# EAGLE board misko_3_board (EAGLE 8.1.1)
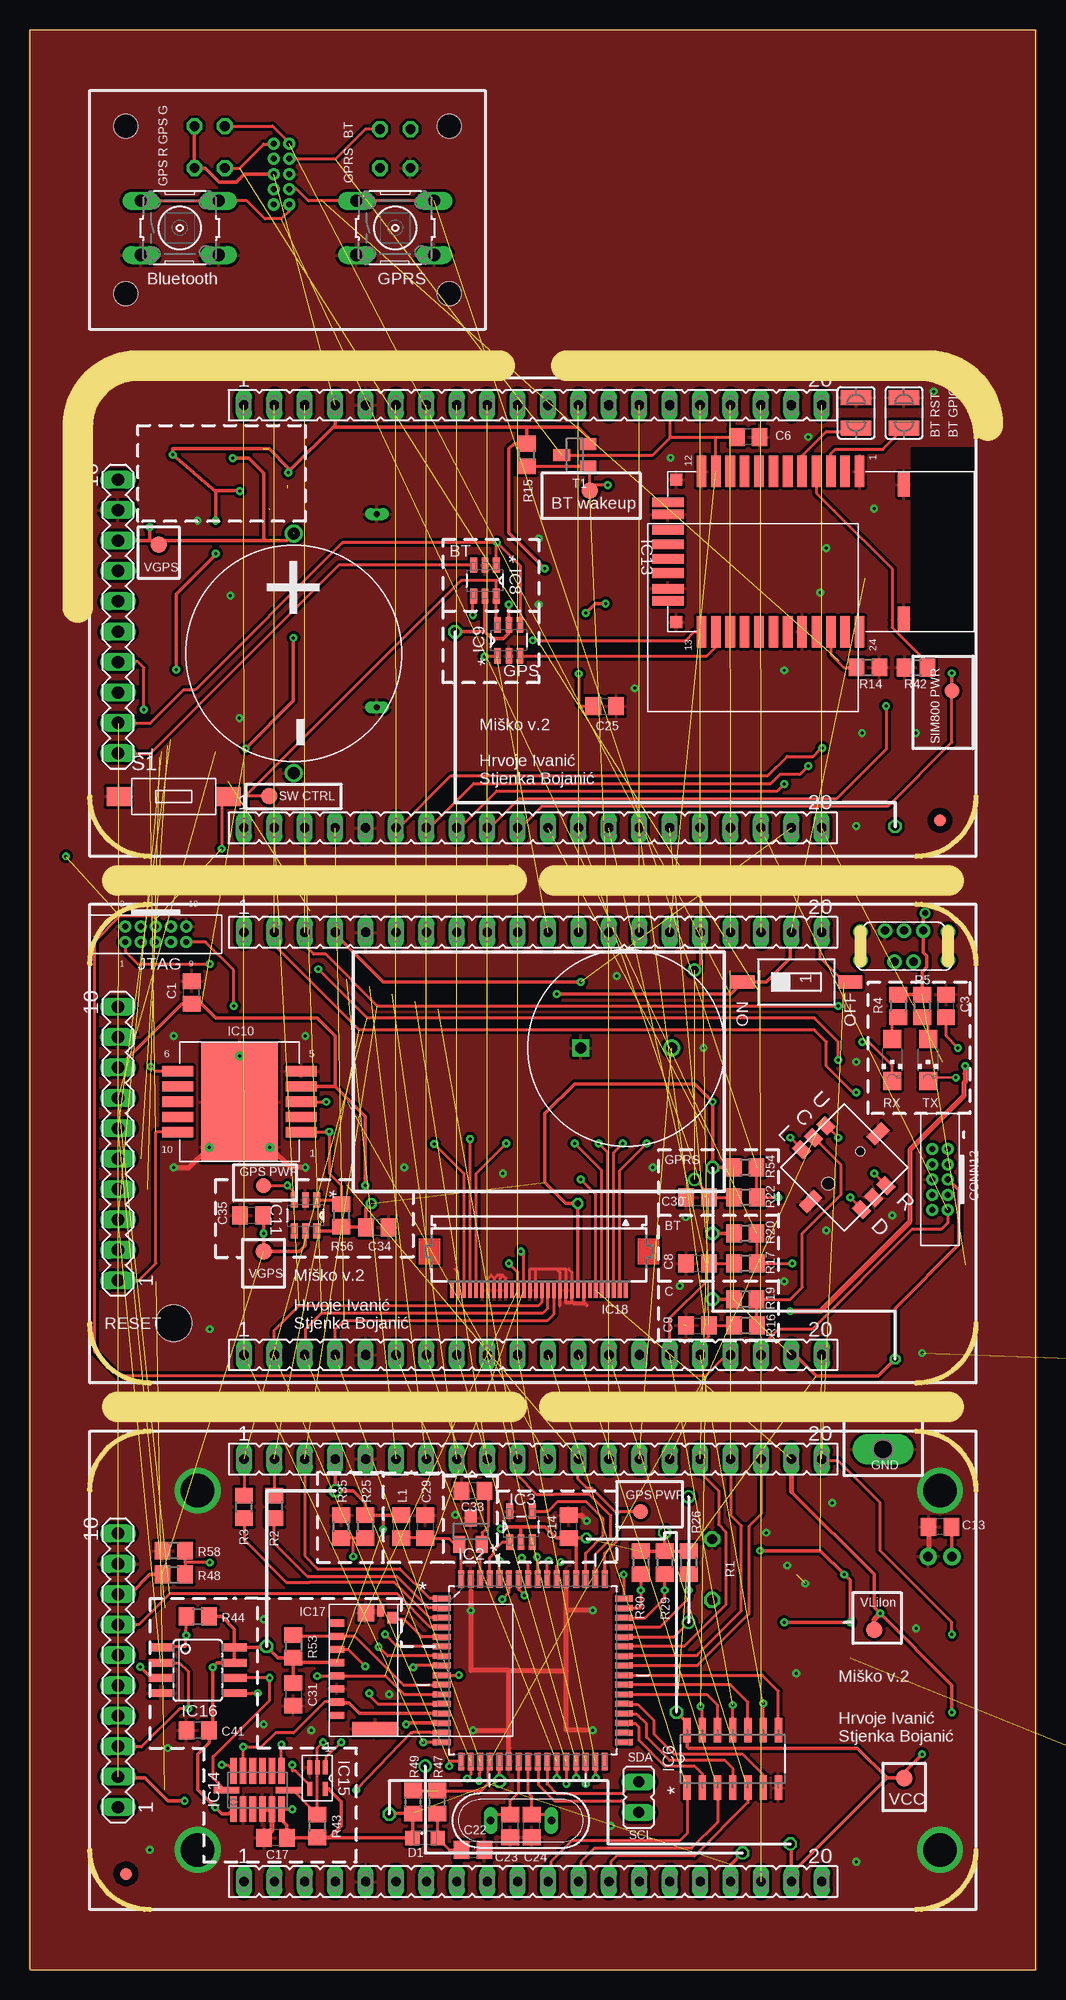
[diagram p6: board, top side]
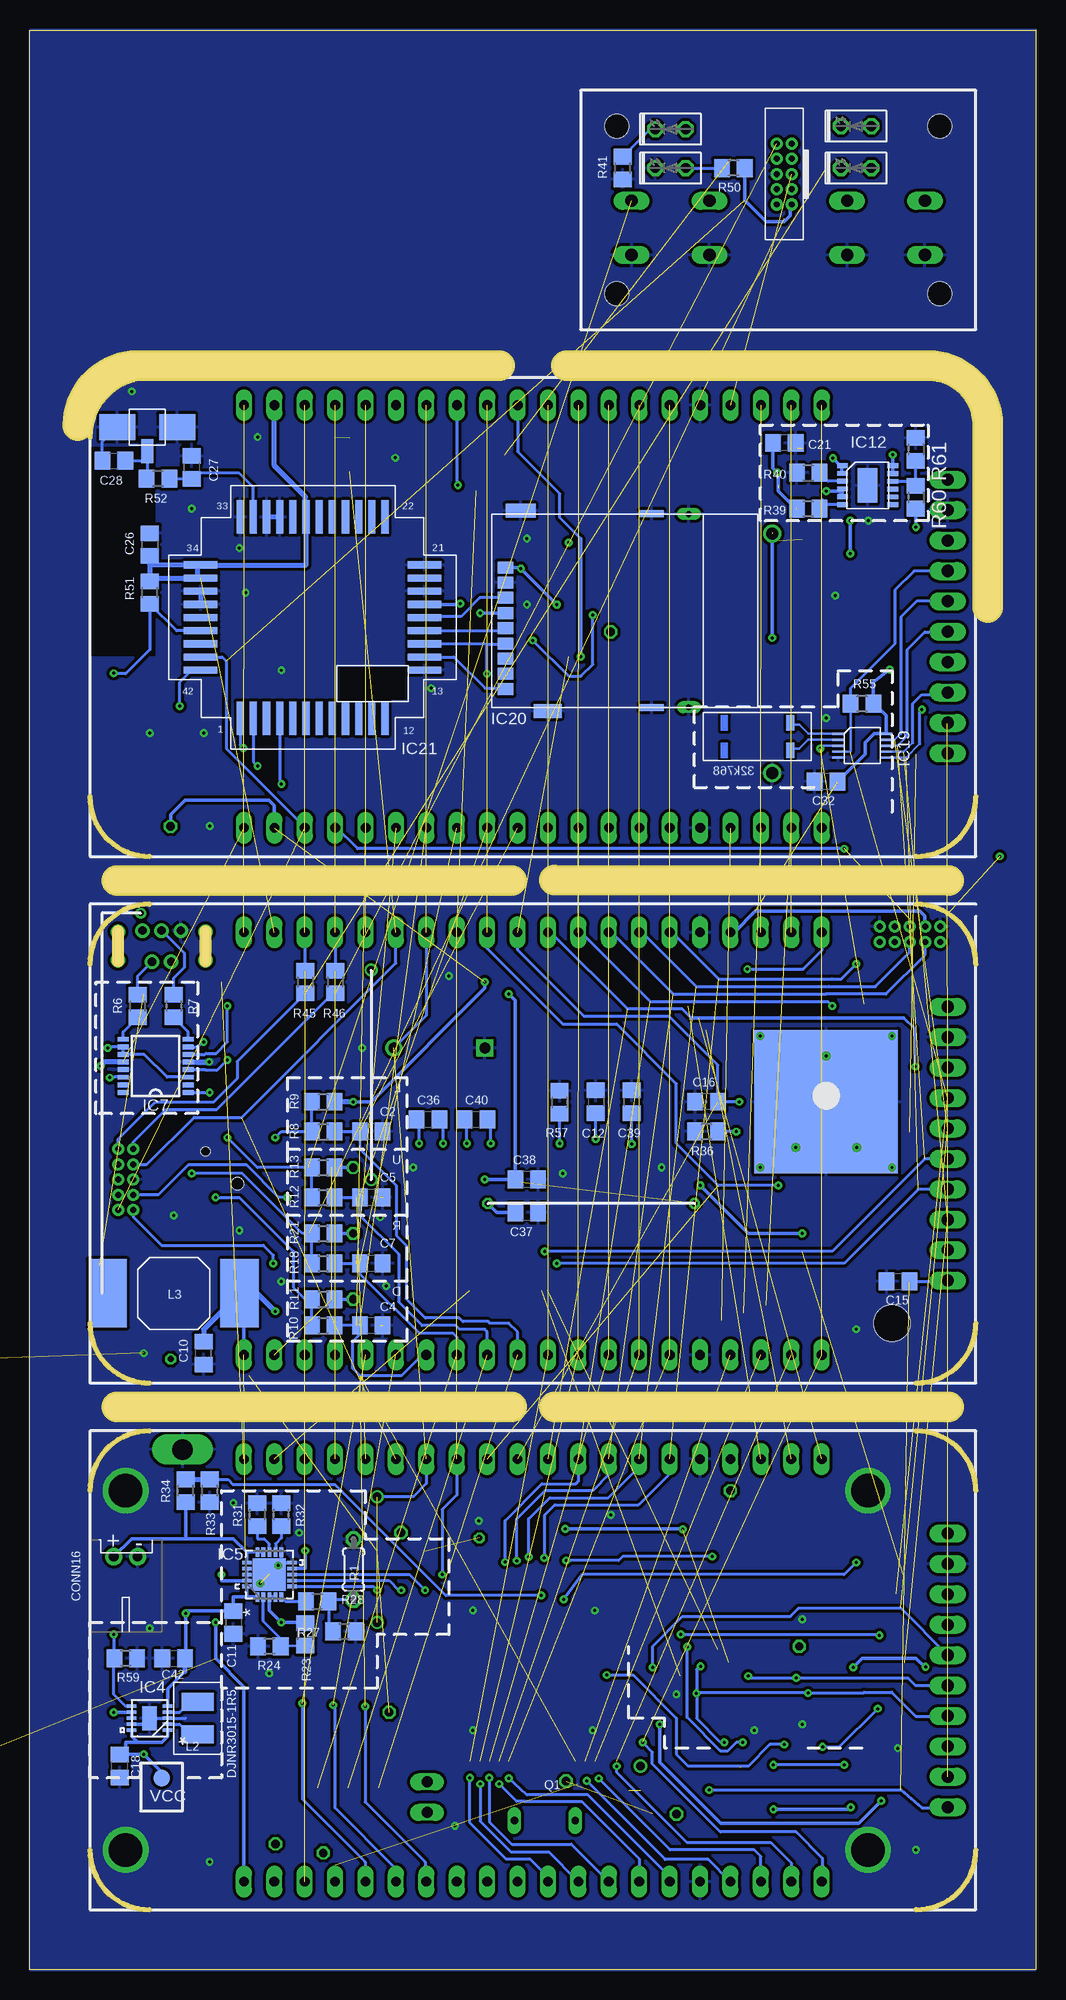
[diagram p7: board, bottom side, seen from below]

Size 84.01 x 162.04 mm. Coordinates in mm from the lower left corner, seen from the top.
Outline: 0,162.04 0,0.04
Outline: 0.01,0 84.01,0 84.01,162 0.01,162
Copper layers (1*16): Top 0.035mm / dielectric 1.5mm / Bottom 0.035mm
Design rules "default": minimum track width 0.25mm, minimum drill 0.25mm, track to track 0.25mm, track to pad 0.25mm, pad to pad 0.25mm, via to via 0.25mm, smd to smd 0.25mm, copper to edge 0mil, drill to drill 0.5mm, minimum pad ring 10mil, minimum via ring 8mil, stop-mask expansion 4mil, vias tented up to drill 0mil, thermal gap 10mil
Net classes: 0 GND: width 0.4 mm, drill 0.25 mm, clearance 0.1 mm; 1 VCC: width 0.3 mm, drill 0.25 mm, clearance 0.1 mm to class 0, clearance 0.1 mm; 2 signal: width 0.25 mm, drill 0.25 mm, clearance 0.1 mm to class 0, clearance 0.1 mm to class 1, clearance 0.1 mm; 3 signal cross-board: width 0.25 mm, drill 0.25 mm, clearance 0.1 mm to class 0, clearance 0.1 mm to class 1, clearance 0.1 mm to class 2, clearance 0.1 mm
Holes 2 mm at 8.01,154 8.01,140 35.01,140 35.01,154
Holes 3 mm at 12.01,54
Milling: 24 lines

## Footprints (pad centres in the part's own frame; a part is rotated, then mirrored left to right if it is on the bottom)
C0805 = smd 1.3 x 1.5: 1 -0.95,0; 2 0.95,0
TH = drill 1: + 20,0; - 0,0
E22-10 = drill 1.016 pad 3.15: + -11.43,0 | drill 1.016 pad 3.15 octagon: - 11.43,0
MA10-1 = drill 1.016 long: 1 -11.43,0; 2 -8.89,0; 3 -6.35,0; 4 -3.81,0; 5 -1.27,0; 6 1.27,0; 7 3.81,0; 8 6.35,0; 9 8.89,0; 10 11.43,0
FE20 = drill 0.813 long: 1 -24.13,0; 2 -21.59,0; 3 -19.05,0; 4 -16.51,0; 5 -13.97,0; 6 -11.43,0; 7 -8.89,0; 8 -6.35,0; 9 -3.81,0; 10 -1.27,0; 11 1.27,0; 12 3.81,0; 13 6.35,0; 14 8.89,0; 15 11.43,0; 16 13.97,0; 17 16.51,0; 18 19.05,0; 19 21.59,0; 20 24.13,0
TH' = drill 0.5 pad 0.9: 1 -2.54,-0.64; 2 -2.54,0.63; 3 -1.27,-0.64; 4 -1.27,0.63; 5 0,-0.64; 6 0,0.63; 7 1.27,-0.64; 8 1.27,0.63; 9 2.54,-0.64; 10 2.54,0.63
JP1 = drill 0.914 long: 1 0,-1.27; 2 0,1.27
TH'' = drill 0.7: DN -0.8,1.3; DP 0,-1.3; GND1 1.6,-1.3; GND2 3.65,-1.2; GND3 3.65,1.2; GND4 -3.65,1.2; GND5 -3.65,-1.2; ID 0.8,1.3; VBUS -1.6,-1.3
SMD = smd 3 x 2.2: GND1 -2.5,0; GND2 2.5,0 | smd 1 x 2: SIGNAL 0,-2
JST-PH-2-THM-RA = drill 0.8 pad 1.422: 1 1,0; 2 -1,0
D0805 = smd 1.2 x 1.2: A 1.05,0; C -1.05,0
DIODE_F126Z12 = drill 1.016 long: A 6.35,0; C -6.35,0
FIDUCIAL_1MM = smd 1 x 1: 1 0,0
QFP80P1600X1600X120-64N = smd 1.473 x 0.508: 1 -7.62,5.994; 2 -7.62,5.207; 3 -7.62,4.394; 4 -7.62,3.607; 5 -7.62,2.794; 6 -7.62,2.007; 7 -7.62,1.194; 8 -7.62,0.406; 9 -7.62,-0.406; 10 -7.62,-1.194; 11 -7.62,-2.007; 12 -7.62,-2.794; 13 -7.62,-3.607; 14 -7.62,-4.394; 15 -7.62,-5.207; 16 -7.62,-5.994; 33 7.62,-5.994; 34 7.62,-5.207; 35 7.62,-4.394; 36 7.62,-3.607; 37 7.62,-2.794; 38 7.62,-2.007; 39 7.62,-1.194; 40 7.62,-0.406; 41 7.62,0.406; 42 7.62,1.194; 43 7.62,2.007; 44 7.62,2.794; 45 7.62,3.607; 46 7.62,4.394; 47 7.62,5.207; 48 7.62,5.994 | smd 0.508 x 1.473: 17 -5.994,-7.62; 18 -5.207,-7.62; 19 -4.394,-7.62; 20 -3.607,-7.62; 21 -2.794,-7.62; 22 -2.007,-7.62; 23 -1.194,-7.62; 24 -0.406,-7.62; 25 0.406,-7.62; 26 1.194,-7.62; 27 2.007,-7.62; 28 2.794,-7.62; 29 3.607,-7.62; 30 4.394,-7.62; 31 5.207,-7.62; 32 5.994,-7.62; 49 5.994,7.62; 50 5.207,7.62; 51 4.394,7.62; 52 3.607,7.62; 53 2.794,7.62; 54 2.007,7.62; 55 1.194,7.62; 56 0.406,7.62; 57 -0.406,7.62; 58 -1.194,7.62; 59 -2.007,7.62; 60 -2.794,7.62; 61 -3.607,7.62; 62 -4.394,7.62; 63 -5.207,7.62; 64 -5.994,7.62
SOT23 = smd 1 x 1.4: 1 -0.95,-1.1; 2 0.95,-1.1; 3 0,1.1
SOT95P280X145-5N = smd 1.27 x 0.559: 1 -1.295,0.94; 2 -1.295,0; 3 -1.295,-0.94; 4 1.295,-0.94; 5 1.295,0.94
NEWPVSON-N10 = smd 0.8 x 0.28: 1 -1.5,1; 2 -1.5,0.5; 3 -1.5,0; 4 -1.5,-0.5; 5 -1.5,-1; 6 1.5,-1; 7 1.5,-0.5; 8 1.5,0; 9 1.5,0.5; 10 1.5,1 | smd 1.2 x 2: 11 0,0
QFN50P400X400X100-21N = smd 0.813 x 0.305: 1 -1.88,0.991; 2 -1.88,0.508; 3 -1.88,0; 4 -1.88,-0.508; 5 -1.88,-0.991; 11 1.88,-0.991; 12 1.88,-0.508; 13 1.88,0; 14 1.88,0.508; 15 1.88,0.991 | smd 0.305 x 0.813: 6 -0.991,-1.88; 7 -0.508,-1.88; 8 0,-1.88; 9 0.508,-1.88; 10 0.991,-1.88; 16 0.991,1.88; 17 0.508,1.88; 18 0,1.88; 19 -0.508,1.88; 20 -0.991,1.88 | smd 2.743 x 2.743: 21 0,0
SOIC127P600X175-14N = smd 2.057 x 0.61: 1 -4.801,7.62; 2 -4.801,6.35; 3 -4.801,5.08; 4 -4.801,3.81; 5 -4.801,2.54; 6 -4.801,1.27; 7 -4.801,0; 8 0,0; 9 0,1.27; 10 0,2.54; 11 0,3.81; 12 0,5.08; 13 0,6.35; 14 0,7.62
SSOP16 = smd 0.914 x 0.406: 1 -2.718,2.223; 2 -2.718,1.587; 3 -2.718,0.953; 4 -2.718,0.318; 5 -2.718,-0.318; 6 -2.718,-0.953; 7 -2.718,-1.587; 8 -2.718,-2.223; 9 2.718,-2.223; 10 2.718,-1.587; 11 2.718,-0.953; 12 2.718,-0.318; 13 2.718,0.318; 14 2.718,0.953; 15 2.718,1.587; 16 2.718,2.223
SOT95P280X145-6N = smd 1.27 x 0.559: 1 -1.295,0.94; 2 -1.295,0; 3 -1.295,-0.94; 4 1.295,-0.94; 5 1.295,0; 6 1.295,0.94
PACKAGE = smd 2.591 x 0.864: 1PPS 5.168,-1.27; CTS -5.168,1.27; GND3 5.168,2.54; ON_OFF 5.168,-2.54; RESET -5.168,0; RTS -5.168,-1.27; RX -5.168,-2.54; TX 5.168,0; VCC 5.168,1.27; WAKEUP -5.168,2.54 | smd 12 x 12 bottom: GND1 0,0 | smd 6.4 x 10: GND2 0,0 | drill 0.25: GND4 -2.54,-3.81; GND5 2.54,-3.81; GND6 0,3.81
MSOP = smd 0.4 x 0.9: !PFO! 1.01,2.05; EN 1.65,-2.15; FB 1,-2.15; PFI 0.36,2.05; PFI_RET 1.66,2.05; PROG -0.3,-2.15; SEL 0.35,-2.15; VIN1 -0.94,2.05; VIN2 -1.59,2.05; VMID -0.29,2.05; VOUT1 -1.6,-2.15; VOUT2 -0.95,-2.15 | smd 2.9 x 1.6: GND 0.05,-0.05
RN-42 = smd 0.8 x 2.6: AIO0 10.8,0; AIO1 2.6,0; GND4 3.6,0; GND5 9.8,0; GPIO8 8.5,0; GPIO9 7.3,0; GPIO10 6.1,0; GPIO11 4.9,0 | smd 2.6 x 0.8: GND1 0,16; GND2 0,2.8; GPIO2 13.4,10; GPIO3 13.4,11.2; GPIO4 13.4,13.6; GPIO5 13.4,12.4; GPIO6 0,13.6; GPIO7 0,12.4; PCM_CLK 0,8.8; PCM_IN 0,6.4; PCM_OUT 0,5.2; PCM_SYNC 0,7.6; RESET 0,11.2; SPI_CLOCK 0,10; SPI_CSB 13.4,14.8; SPI_MISO 13.4,16; SPI_MOSI 0,14.8; UART_CTS 13.4,6.4; UART_RTS 13.4,5.2; UART_RX 13.4,2.8; UART_TX 13.4,4; USB_DN 13.4,8.8; USB_DP 13.4,7.6; VDD 0,4 | smd 1 x 1: GND3 0.7,0.7; GND6 12.6,0.7 | smd 2 x 1: GND7 12.3,19.7; GND8 1.1,19.7
LGA14 = smd 0.55 x 2.145: !CS! 0,-2.6; SCL 0,2.6 | smd 2.145 x 0.55: GND1 -1.6,-1.2; GND2 -1.6,-0.4; GND3 -1.6,1.2; INT1 1.6,-2; INT2 1.6,-1.2; NC 1.6,-0.4; RESERVED1 1.6,0.4; RESERVED2 -1.6,0.4; SDA 1.6,2; SDO 1.6,1.2; VCC -1.6,-2; VDD -1.6,2
SOT353/5 = smd 0.4 x 1.2: A 0,-0.9; B -0.65,-0.9; GND 0.65,-0.9; VCC -0.65,0.9; Y 0.65,0.9
SOIC08 = smd 0.66 x 2.032: !CS! -1.905,-3.073; !HOLD! -0.635,3.073; !WP! 0.635,-3.073; GND 1.905,-3.073; SCK 0.635,3.073; SI 1.905,3.073; SO -0.635,-3.073; VCC -1.905,3.073
MICRO_SD_CONNECTOR = smd 0.6 x 1.25: CD/DAT3 8.35,-0.63; CLK 5.05,-0.63; CMD 7.25,-0.63; DAT0 2.85,-0.63; DAT1 1.75,-0.63; DAT2 9.45,-0.63; VDD 6.15,-0.63; VSS 3.95,-0.63 | smd 0.95 x 0.85: DET 9.9,-5.27 | smd 1.45 x 1.4: GND2 10.3,-3.05 | smd 1.2 x 3.79: GND4 0.6,-3.81 | smd 1 x 0.6: POL 10.5,-4.3
FH12-30S-0.5SH = smd 0.3 x 1.3: 1 -7.25,3.25; 2 -6.75,3.25; 3 -6.25,3.25; 4 -5.75,3.25; 5 -5.25,3.25; 6 -4.75,3.25; 7 -4.25,3.25; 8 -3.75,3.25; 9 -3.25,3.25; 10 -2.75,3.25; 11 -2.25,3.25; 12 -1.75,3.25; 13 -1.25,3.25; 14 -0.75,3.25; 15 -0.25,3.25; 16 0.25,3.25; 17 0.75,3.25; 18 1.25,3.25; 19 1.75,3.25; 20 2.25,3.25; 21 2.75,3.25; 22 3.25,3.25; 23 3.75,3.25; 24 4.25,3.25; 25 4.75,3.25; 26 5.25,3.25; 27 5.75,3.25; 28 6.25,3.25; 29 6.75,3.25; 30 7.25,3.25
10UMAX = smd 1 x 0.2: !CS! -2,-0.5; !INT! 2,0.5; DIN 2,-1; DOUT 2,-0.5; GND -2,-1; SCLK 2,0; VBACK -2,0; VCC 2,1; X1 -2,1; X2 -2,0.5
115Q-BCA0 = smd 1 x 1.3: CD 1.54,-1.13; CLK 6.62,-1.13; GND1 10.43,-1.13; I/O 5.35,-1.13; RESERVED1 4.08,-1.13; RESERVED2 2.81,-1.13; RST 9.16,-1.13; VCC 11.7,-1.13; VPP 7.89,-1.13 | drill 0.5 long: GND2 16.15,-16.45; GND7 0.01,-16.45 | smd 1.15 x 2.35: GND3 -0.3,-4.65 | smd 1.15 x 2.5: GND4 16.45,-2.4 | smd 0.6 x 2: GND5 0,-13.34; GND6 16.2,-13.34
SIM800C = smd 2.8 x 0.6: ADC -9.35,0; BT_ANT 9.35,3.3; GND2 9.35,-4.4; GND3 9.35,2.2; GND4 9.35,4.4; GND9 -9.35,2.2; GND10 -9.35,1.1; NETLIGHT -9.35,-3.3; PWRKEY -9.35,-1.1; SIM_CLK 9.35,-1.1; SIM_DATA 9.35,-2.2; SIM_DET 9.35,-3.3; SIM_RST 9.35,0; SIM_VDD 9.35,1.1; STATUS -9.35,-4.4; VBAT1 -9.35,4.4; VBAT2 -9.35,3.3; VDD_EXT -9.35,-2.2 | smd 0.6 x 2.8: GND1 1.65,-8.4; GND5 0.55,8.4; GND6 -2.75,8.4; GND7 -3.85,8.4; GND8 -6.05,8.4; GSM_ANT -4.95,8.4; MICN 3.85,-8.4; MICP 2.75,-8.4; RF_SYNC -1.65,8.4; SPKN 6.05,-8.4; SPKP 4.95,-8.4; UART1_CTS -2.75,-8.4; UART1_DCD -1.65,-8.4; UART1_DTR -0.55,-8.4; UART1_RI 0.55,-8.4; UART1_RTS -3.85,-8.4; UART1_RXD -4.95,-8.4; UART1_TXD -6.05,-8.4; UART2_RXD 4.95,8.4; UART2_TXD 6.05,8.4; USB_DN 1.65,8.4; USB_DP 2.75,8.4; USB_VBUS 3.85,8.4; VRTC -0.55,8.4
SJW = smd 1.27 x 2.54: 1 -1.27,0; 2 1.27,0
L0805 = smd 1.3 x 1.5: 1 -0.95,0; 2 0.95,0
FFF = smd 1.5 x 2.7: P$1 1.35,-0.01; P$2 -1.35,0.01
DJNR6045-100-S = smd 3.2 x 5.7: P$1 -5.5,0; P$2 5.5,0
LED2X5 = drill 0.813 octagon: A -1.27,0; K 1.27,0
CHIPLED_1206 = smd 1.5 x 1.5: A 0,-1.75; C 0,1.75
QS = drill 0.61 long: 1 -2.54,0; 2 2.54,0
SMD' = smd 0.635 x 1.27: XTAL1 -2.75,-1.15; XTAL2 -2.75,1.15
0204/5 = drill 0.813 octagon: 1 -2.54,0; 2 2.54,0
R0805 = smd 1.3 x 1.5: 1 -0.95,0; 2 0.95,0
DTSM-32N-B = smd 2 x 1.6: 1 -4.6,0; 2 4.6,0
SMS-001 = smd 1.092 x 2.007: 1 0,-4.496; 2 0,4.496
MICROJOYSTICK = smd 1.3 x 1: CENTER -3.575,-0.035; DOWN 3.52,-1.46; GND1 3.52,-0.035; LEFT -3.57,-1.46; RIGHT 3.52,1.39; UP -3.555,1.405 | smd 1 x 1.8: GND2 0,4; GND3 0,-4 | hole 0.75: 0,1.9 | hole 1.05: 0,-1.9
B3F-10XX = drill 1.016 long: 1 -3.251,2.261; 2 3.251,2.261; 3 -3.251,-2.261; 4 3.251,-2.261
P1-17Y = drill 1.702 pad 2.121 long: TP 0,0
TP14R = smd 1.4 x 1.4: TP 0,0
B1,27 = smd 1.27 x 1.27: TP 0,0
F/UCW03LF = drill 0.9 square: GND 0,0 | drill 0.9: SIGNAL 7.6,0

## Placement (x,y rotation side)
C1  1µF  [C0805]  13.5,81.62 90 top
C2  0.47µF  [C0805]  55.51,70 180 bottom
C3  0.1µF  [C0805]  76.51,80.5 90 top
C4  0.47µF  [C0805]  55.51,53.8 180 bottom
C5  0.47µF  [C0805]  55.51,64.5 180 bottom
C6  10µF  [C0805]  60,128.04 180 top
C7  0.47µF  [C0805]  55.51,59 180 bottom
C8  0.47µF  [C0805]  55.76,59 0 top
C9  0.47µF  [C0805]  55.76,53.8 0 top
C10  0.1µF  [C0805]  69.51,51.5 90 bottom
C11  10µF  [C0805]  67.01,29 270 bottom
C12  4.7µF / 25V  [C0805]  36.74,72.5 270 bottom
C13  10µF  [C0805]  76.01,37 180 top
C14  0.1µF  [C0805]  45.01,37 90 top
C15  18pF  [C0805]  11.51,57.5 0 bottom
C16  18pF  [C0805]  27.51,72.5 180 bottom
C17  0.1µF  [C0805]  20.51,11 180 top
C18  10µF  [C0805]  76.51,17 90 bottom
C21  0.1µF  [C0805]  21,127.54 180 bottom
C22  0.1µF  [C0805]  37.01,10 180 top
C23  15pF  [C0805]  40.11,12 90 top
C24  15pF  [C0805]  41.91,12 90 top
C25  10µF  [C0805]  48,105.54 0 top
C26  0.1µF  [C0805]  74,119.04 270 bottom
C27  10µF  [C0805]  70.51,125.5 270 bottom
C28  10µF  [C0805]  77,126.04 0 bottom
C29  0.1µF  [C0805]  33.01,37 270 top
C30  0.47µF  [C0805]  55.76,64.5 0 top
C31  0.1µF  [C0805]  22.01,23 270 top
C32  0.1µF  [C0805]  17.51,99.25 180 bottom
C33  10µF  [C0805]  37.01,40 180 top
C34  0.1µF  [C0805]  29.01,62 180 top
C35  1nF  [C0805]  18.51,63 180 top
C36  1µF  [C0805]  50.76,71 180 bottom
C37  1µF  [C0805]  42.51,63.25 180 bottom
C38  1µF  [C0805]  42.51,66 180 bottom
C39  2.2µF  [C0805]  33.76,72.5 270 bottom
C40  1µF  [C0805]  46.76,71 180 bottom
C41  0.1µF  [C0805]  14.01,20 180 top
C42  4.7µF  [C0805]  72.01,26 0 bottom
C43  EECS5R5H155  [TH]  22.02,99.96 90 top
C44  1000µF  [E22-10]  116.01,39 90 top  (outside the outline)
C45  1000µF  [E22-10]  128.01,39 90 top  (outside the outline)
C46  1000µF  [E22-10]  140.01,39 90 top  (outside the outline)
C47  1000µF  [E22-10]  152.01,39 90 top  (outside the outline)
C49  1000µF  [E22-10]  104.01,39 90 top  (outside the outline)
CONN1  bottom  [MA10-1]  7.36,25 90 top
CONN2  bottom left  [FE20]  42.01,42.65 0 top
CONN3  bottom right  [FE20]  42.01,7.35 0 top
CONN4  mid  [MA10-1]  7.35,113.04 90 top
CONN5  mid left  [FE20]  42,130.69 0 top
CONN6  mid right  [FE20]  42,95.38 0 top
CONN7  top  [MA10-1]  7.36,69 90 top
CONN8  top left  [FE20]  42.01,86.65 0 top
CONN9  top right  [FE20]  42.01,51.35 0 top
CONN10  JTAG  [TH']  10.51,86.5 0 top
CONN11  I2C  [JP1]  50.84,14.4 0 top
CONN12  board  [TH']  76.01,66 270 top
CONN13  lid  [TH']  21.01,150 270 bottom
CONN14  MX500075-1517USB_MINI-B  [TH'']  73.01,85.5 180 top
CONN15  U.FL-R-SMT 1  [SMD]  74.22,128.86 0 bottom
CONN16  LiPo Battery  [JST-PH-2-THM-RA]  76.01,34.5 180 bottom
D1  1N4148  [D0805]  33.01,11 0 top
D2  [DIODE_F126Z12]  102.01,15 180 top  (outside the outline)
FI1  FIDUCIAL  [FIDUCIAL_1MM]  8.01,8 0 top
FI2  FIDUCIAL  [FIDUCIAL_1MM]  76.01,96 0 top
IC1  ATMEGA1281-16AU  [QFP80P1600X1600X120-64N]  42.01,25 0 top
IC2  MC1525TT  [SOT23]  36.8,36.62 0 top
IC3  TMP36GRTZ  [SOT95P280X145-5N]  41.01,37 90 top
IC4  TPS63031  [NEWPVSON-N10]  74.01,21 180 bottom
IC5  MCP73871-2AAI/ML  [QFN50P400X400X100-21N]  64.01,33 90 bottom
IC6  SN74HCT14DR  [SOIC127P600X175-14N]  62.51,20 90 top
IC7  FT230XS  [SSOP16]  73.51,75.5 180 bottom
IC8  SN74LVC1G3157DBVR - BT switch  [SOT95P280X145-6N]  38,116.04 270 top
IC9  SN74LVC1G3157DBVR - GPS switch  [SOT95P280X145-6N]  40,111.04 90 top
IC10  ORG1510-MK4  [PACKAGE]  17.51,72.5 0 top
IC11  TPS3808G33DBVT  [SOT95P280X145-6N]  23.01,63 270 top
IC12  LTC4425  [MSOP]  14,124.04 270 bottom
IC13  RN-42  [RN-42]  53.29,125.16 270 top
IC14  ADXL345  [LGA14]  19.01,15 90 top
IC15  74HCT1G32  [SOT353/5]  24.01,16 180 top
IC16  FM25W256-SOIC  [SOIC08]  14.01,25 270 top
IC17  MICROSD_SPI_MODE  [MICRO_SD_CONNECTOR]  25.01,19.5 90 top
IC18  FH12-30S-0.5SH  [FH12-30S-0.5SH]  42.51,60 180 top
IC19  DS1394U-33+  [10UMAX]  14.51,102.25 0 bottom
IC20  115Q-BCA0  [115Q-BCA0]  45.42,105.44 90 bottom
IC21  SIM800  [SIM800C]  60.4,112.95 0 bottom
JP2  GPIO6  [SJW]  73,130.04 270 top
JP3  RESET  [SJW]  69,130.04 270 top
L1  33µH  [L0805]  31.01,37 270 top
L2  DJNR3015-1R5  [FFF]  70.01,21 90 bottom
L3  DJNR6045-100-S  [DJNR6045-100-S]  72.01,56.5 0 bottom
LED1  green  [LED2X5]  15.01,154 180 bottom
LED2  red  [LED2X5]  15.01,150.5 180 bottom
LED3  yellow  [CHIPLED_1206]  72.01,76 180 top
LED4  yellow  [CHIPLED_1206]  75.01,76 180 top
LED5  blue  [LED2X5]  30.51,153.75 180 bottom
LED6  red  [LED2X5]  30.51,150.5 180 bottom
Q1  8MHz  [QS]  41.01,12.45 180 top
Q2  LFXTAL016178R  [SMD']  23.26,103 180 bottom
R1  NTC 10k  [0204/5]  56.98,33.42 90 bottom
R2  3k3  [R0805]  20.42,38.65 90 top
R3  3k3  [R0805]  17.88,38.65 90 top
R4  1k  [R0805]  72.51,80.5 270 top
R5  1k  [R0805]  74.51,80.5 270 top
R6  27  [R0805]  75.01,80.5 90 bottom
R7  27  [R0805]  72.01,80.5 270 bottom
R8  47k  [R0805]  59.51,70 0 bottom
R9  1k  [R0805]  59.51,72.5 0 bottom
R10  47k  [R0805]  59.51,53.8 0 bottom
R11  1k  [R0805]  59.51,56 0 bottom
R12  47k  [R0805]  59.51,64.5 0 bottom
R13  1k  [R0805]  59.51,67 0 bottom
R14  100k  [R0805]  70,108.79 0 top
R15  1k  [R0805]  41.5,126.53 90 top
R16  47k  [R0805]  59.76,53.8 180 top
R17  47k  [R0805]  59.77,59 180 top
R18  47k  [R0805]  59.51,59 0 bottom
R19  1k  [R0805]  59.75,56 180 top
R20  1k  [R0805]  59.75,61.5 180 top
R21  1k  [R0805]  59.51,61.5 0 bottom
R22  47k  [R0805]  59.76,64.5 180 top
R23  100k  [R0805]  61.01,28 270 bottom
R24  270k  [R0805]  64.01,27 180 bottom
R25  150k  [R0805]  28.01,37 270 top
R26  47k  [R0805]  55.01,34 270 top
R27  270k  [R0805]  57.76,28.26 0 bottom
R28  1k  [R0805]  60.01,30.75 0 bottom
R29  47k  [R0805]  53.01,34 270 top
R30  47k  [R0805]  51.01,34 270 top
R31  1k  [R0805]  65.01,38 90 bottom
R32  100k  [R0805]  63.01,38 90 bottom
R33  150k  [R0805]  69.01,40 270 bottom
R34  150k  [R0805]  71.01,40 90 bottom
R35  150k  [R0805]  26.01,37 90 top
R36  10k  [R0805]  27.51,70 180 bottom
R39  1k  [R0805]  19,122.04 0 bottom
R40  10k  [R0805]  19,125.04 0 bottom
R41  1k  [R0805]  34.51,150.5 90 bottom
R42  10k  [R0805]  74,108.78 0 top
R43  10k  [R0805]  24.01,12 90 top
R44  10k  [R0805]  14.01,29.5 0 top
R45  1k  [R0805]  61.01,82.5 270 bottom
R46  1k  [R0805]  58.51,82.5 270 bottom
R47  47k  [R0805]  34.01,14 90 top
R48  150k  [R0805]  12.01,33 0 top
R49  4k7  [R0805]  32.01,14 90 top
R50  1k  [R0805]  25.26,150.5 180 bottom
R51  47k  [R0805]  74,115.04 90 bottom
R52  1k  [R0805]  73.31,124.56 180 bottom
R53  10k  [R0805]  22.01,27 270 top
R54  1k  [R0805]  59.75,67 180 top
R55  10k  [R0805]  14.51,105.75 180 bottom
R56  1M  [R0805]  26.01,63 270 top
R57  390k  [R0805]  39.78,72.46 270 bottom
R58  150k  [R0805]  12.01,35 180 top
R59  150k  [R0805]  76.01,26 180 bottom
R60  470k  [R0805]  10.01,123 270 bottom
R61  470k  [R0805]  10.01,127 270 bottom
S1  [DTSM-32N-B]  12.01,98 0 top
S2  POWER_SWITCH  [SMS-001]  64.01,82.5 90 top
S3  MICROJOYSTICK  [MICROJOYSTICK]  68.01,67 315 top
S4  gprs  [B3F-10XX]  30.51,145.5 0 top
S5  bt  [B3F-10XX]  12.51,145.5 0 top
T1  BSS84  [SOT23]  45.51,126.5 90 top
TP1  GND  [P1-17Y]  71.26,43.45 270 top
TP2  VCC  [TP14R]  73.01,16 0 bottom
TP3  Analogue Switch CRTL Pin  [TP14R]  20,98.04 0 top
TP4  VCC  [TP14R]  73.01,16 0 top
TP5  GPS Power CTRL Pin  [B1,27]  51.01,38.25 0 top
TP6  GPS Power CTRL Pin  [B1,27]  19.51,65.5 0 top
TP7  SIM800 Power CTRL Pin  [B1,27]  77,106.84 0 top
TP8  VLiIon Regulated  [TP14R]  70.51,28.4 0 top
TP9  Bluetooth Wakeup Pin  [TP14R]  46.75,123.54 0 top
TP10  VGPS  [TP14R]  10.75,119.04 0 top
TP11  VGPS  [TP14R]  19.51,60 0 top
U$1  F/UCW03F  [F/UCW03LF]  46.01,77 0 top

## Tracks (layer width: path | path; a pad name or v marks a point on that pad's centre or on a via)
5V0  (via drill 0.25)  (3 unrouted)
  Top 0.3: v63.01,29 v68.51,29 68.51,32.5 v68.01,33 66.01,35 v61.01,35
  Top 0.4: 78.01,73 78.01,74.08 78.12,74.19 78.12,74.83 78.11,74.84 v78.11,75.5
  Top 0.406: v63.51,55 66.01,55 73.51,62.5 73.51,68.5 78.01,73
  Bottom 0.3: v68.01,33 68.01,32.49 IC5.19 IC5.18 IC5.17 | IC5.4 IC5.3 64.01,30 v63.01,29 61.06,29 R23.1 | v68.51,29 68.51,26 66.14,23.63 CONN3.20 | 61.6,33.51 IC5.9 61.01,33.51 v61.01,35
  Bottom 0.305: L3.P$2 66.14,56.5 CONN9.20
  Bottom 0.406: C10.2 69.51,53.5 L3.P$2 65.01,56.5 v63.51,55 | IC7.12 77.79,75.82 v78.11,75.5
ADXL345_INT1_INTERRUPT_PIN  (via drill 0.25)
  Top 0.25: IC1.9 35.57,24.59 v35.83,24.61 | IC14.INT1 v21.01,18.8
  Bottom 0.25: v35.83,24.61 33.62,24.61 30.01,21 30.01,18 29.01,17 24.01,17 22.21,18.8 v21.01,18.8
ADXL345SDA  (via drill 0.25)
  Top 0.25: v16.01,17.1 16.51,17.1 IC14.SDA | 23.36,15.55 IC15.Y | v21.91,17.1 21.91,16.59 22.17,16.59 23.36,15.4 IC15.Y | IC15.Y 23.36,15.2
  Bottom 0.25: v16.01,17.1 v21.91,17.1
ANALOG_SW_CTRL_PIN  (via drill 0.25)  (2 unrouted)
  Top 0.25: IC1.16 33.12,19.01
  Top 0.254: 33.12,19.01 v32.84,18.98 | IC9.6 38.94,112.46 IC8.6 38.94,115.98 39,116.04 36,116.04 18,98.04 | 18,98.04 18,95.51 CONN6.1 | TP3.TP 18,98.04
  Bottom 0.25: v32.84,18.98 32.02,18.16 32.02,17.17 26.35,11.5 20.01,11.5
  Bottom 0.254: 20.01,11.5 17.82,9.31 17.82,7.41 CONN3.1
ANTENNA
  Bottom 0.25: 74.22,126 CONN15.SIGNAL | 74.22,126 74.22,124.6 R52.2 | C28.2 74.26,126.04 74.22,126
AREF
  Top 0.25: IC1.62 37.62,34.61 | C33.1 38.26,40 38.26,37 37.76,36.5 IC2.2
  Top 0.254: 37.62,34.61 38.01,35 38.01,35.26 IC2.2
AVCC
  Top 0.254: L1.2 C29.2 33.06,36 35.01,36 35.49,35.52 IC2.1 36.02,35.35 IC1.64
BAT_A_PIN  (via drill 0.25)
  Top 0.25: IC1.58 40.82,31.75 v41.3,31.26
  Bottom 0.25: R33.1 67.46,40.95 67.01,40.5 58.51,40.5 49.27,31.26 v41.3,31.26
  Bottom 0.406: R34.2 R33.1
BLUE_LED  (4 unrouted)
  Top 0.25: 58.5,128.04 C6.2 | 58.5,128.04 53.54,128.04 53.43,127.93 | 58.54,128 58.5,128.04 | T1.3 52,126.5 53.43,127.93 | LED5.A 28.01,153.75 25.51,151.25 21.67,151.25 | CONN5.15 53.43,127.93 | IC13.VDD 57.29,127.97 57.26,128
  Top 0.254: 59,127.99 C6.2
  Top 0.3: 21.67,151.25 CONN13.3
  Bottom 0.25: CONN12.3 74.24,67.27 70.3,71.21 66.3,71.21 53.44,84.07 CONN8.15
BLUETOOTH  (via drill 0.25)  (2 unrouted)
  Top 0.25: IC6.11 v58.7,22.09 v58.69,22.1 | R17.2 C8.2 56.51,58.8 56.51,57.5 53.44,54.43 CONN9.15
  Bottom 0.25: CONN3.15 53.44,8.43 58.51,13.5 58.51,21.92 v58.69,22.1
BLUETOOTH_RX  (via drill 0.25)
  Top 0.25: v37,113.15 37,114.68 | 54.76,111.04 55.48,111.76 IC13.UART_RX
  Top 0.254: 37,114.68 IC8.4 | v42,111.04 54.76,111.04
  Bottom 0.25: 37,109.04 v37,113.15
  Bottom 0.254: 37,109.04 38,108.04 39,108.04 v42,111.04
BLUETOOTH_TX
  Top 0.25: IC9.3 56.51,109.75 57.26,110.5 57.26,111.73 IC13.UART_TX
BLUETOOTH_WAKEUP_PIN  (via drill 0.25)  (2 unrouted)
  Top 0.25: R15.1 41.53,125.55 T1.1 46.75,125.41 TP9.TP 46.79,124 v48.26,124
  Top 0.254: IC1.48 49.63,32.95 v49.58,33
  Bottom 0.25: 49.58,38.43 v49.58,33 | CONN5.13 48.35,124.09 v48.26,124
  Bottom 0.254: CONN2.13 48.36,39.65 49.58,38.43
BT_GPIO6
  Top 0.25: IC13.GPIO6 66.89,126.63 67.26,127 71.23,127 JP2.2
BT_LED
  Bottom 0.25: 32.21,153.75 R41.2
  Bottom 0.3: LED5.K 32.21,153.75
BT_RST
  Top 0.25: IC13.RESET 64.49,126.48 66.51,128.5 68.73,128.5 JP3.2
BUTTON_BLUETOOTH  (via drill 0.25)  (1 unrouted)
  Top 0.25: R20.1 60.72,61.48 R17.1 v63.68,59 | S5.1 S5.2 18.12,147.76 19.63,146.25 21.01,146.25 21.65,146.89 CONN13.9
  Bottom 0.25: v63.68,59 63.68,59.67 64.51,60.5 73.01,60.5 75.37,62.86 CONN12.9
BUTTON_CENTER
  Top 0.25: R16.1 R19.1 63.51,56 64.51,57 64.51,61.5 67.76,64.75 67.76,67.2 S3.CENTER
BUTTON_DOWN  (via drill 0.25)
  Top 0.25: S3.DOWN 69.47,63.54 v68.51,64.5
  Bottom 0.25: R10.1 R11.1 61.01,56 62.01,57 62.01,60 66.51,64.5 v68.51,64.5
BUTTON_LEFT  (via drill 0.25)
  Top 0.25: S3.LEFT 64.45,68.56 v63.51,69.5
  Bottom 0.25: R9.1 R8.1 63.01,70 v63.51,69.5
BUTTON_RIGHT  (via drill 0.25)
  Top 0.25: S3.RIGHT 71.48,65.53 v70.51,66.5
  Bottom 0.25: R18.1 R21.1 61.26,61.5 66.26,66.5 v70.51,66.5
BUTTON_UP  (via drill 0.25)
  Top 0.25: S3.UP 66.5,70.51 v67.51,69.5
  Bottom 0.25: v67.51,69.5 65.01,67 R13.1 R12.1
BUZZER_PIN  (via drill 0.7)  (3 unrouted)
  Top 0.25: IC1.44 53.8,27.79 v55.01,29
  Bottom 0.25: CONN8.14 50.9,79.71 U$1.SIGNAL | CONN2.14 50.9,40.61 52.01,39.5 v55.01,39.5
CAP1N  (via drill 0.25)
  Top 0.25: v45.51,69 47.75,66.76 IC18.5
  Bottom 0.25: v45.51,69 45.51,70.7 C40.1
CAP1P  (via drill 0.25)
  Top 0.25: IC18.4 48.26,68.25 v47.51,69
  Bottom 0.25: v47.51,69 47.51,70.8 C40.2
CAP2N  (via drill 0.25)
  Top 0.25: v49.51,69 48.77,68.26 IC18.3
  Bottom 0.25: v49.51,69 49.51,70.7 C36.1
CAP2P  (via drill 0.25)
  Top 0.25: v51.51,69 49.28,66.77 49.28,56.77 IC18.2
  Bottom 0.25: v51.51,69 51.51,70.8 C36.2
CBUS1  (via drill 0.25)
  Top 0.25: v77.34,74.51 74.76,74.5 LED4.C
  Bottom 0.25: IC7.14 76.96,74.55 v77.34,74.51
CBUS2  (via drill 0.25)
  Top 0.25: v69.51,77.5 70.04,77.5 72.01,75.53 LED3.C
  Bottom 0.25: IC7.7 70.1,77.09 v69.51,77.5
CENTER  (via drill 0.25)  (2 unrouted)
  Top 0.25: R16.2 C9.2 56.71,52.9 55.98,52.17 CONN9.16 | IC6.9 61.26,20 v61.26,22.25
  Bottom 0.25: CONN3.16 56.01,7.38 56.01,9 61.26,14.25 v61.26,22.25
DOWN  (via drill 0.25)  (2 unrouted)
  Top 0.25: IC6.13 56.16,21.85 v56.01,22
  Bottom 0.25: v56.01,22 56.01,14 51.01,9 51.01,7.46 CONN3.14 | R10.2 C4.2 56.46,53.06 57.06,52.46 57.06,50.24 56.43,49.6 52.99,49.6 51.24,51.35 CONN9.14
EN  (via drill 0.25)  (2 unrouted)
  Top 0.25: S2.1 68.01,82.5 66.01,84.5 66.01,86.52 CONN8.20 | v77.01,28 77.01,29 71.01,35 71.01,39 67.51,42.5 66.29,42.5 CONN2.20
  Bottom 0.25: IC4.6 76.01,22 77.01,23 77.01,25.95 | R59.2 76.96,27.95 v77.01,28
  Bottom 0.254: 77.01,25.95 R59.2
GND  (via drill 0.25, 0.25 pad 0.41, 2.8)  (8 unrouted)
  Top 0.25: IC18.24 38.26,57.75 38.51,58 38.76,57.75 | 38.76,57.75 IC18.23 | IC18.22 39.26,57.75 39.51,58 | 39.51,58 39.01,58 38.76,57.75 | IC18.29 35.76,58.25 35.51,58.5 | IC18.21 39.76,57.75 39.51,58 | IC18.17 41.76,58.5 42.26,58.5 | 44.01,58.5 42.26,58.5 | 44.01,58.5 44.26,58.25 IC18.12 | IC18.16 42.26,58.5 | IC18.11 44.76,58.5 44.01,58.5 | IC18.10 45.26,58.25 45.01,58.5
  Top 0.3: IC18.11 44.76,55.75 45.26,55.75 | 45.26,55.75 45.32,55.75 45.42,55.65 46.36,55.65 | 46.36,55.65 46.51,55.5 | IC18.10 45.26,55.75 | IC18.12 44.26,55.5 | IC18.8 46.26,55.75 46.36,55.65
  Top 0.4: IC1.22 40.01,18.5 | v47.01,30 44.8,30 44.8,30.1 | v37.01,20 40.01,20 40.01,19.8 | v47.01,20 44.8,20 44.8,24.94 | C14.2 46.06,37.95 v46.51,37.5 | v12.01,67 13.28,67 IC10.GND4 | v23.01,67 21.74,67 IC10.GND5 | IC14.GND1 20.21,11.65 C17.2 | IC14.GND2 20.29,13.4 | C13.2 75.06,34.55 CONN16.2
  Top 0.406: IC1.53 44.8,30.1 44.8,24.94 42.01,24.94 42.01,24.98 | 42.01,24.98 42.01,25 | 36.83,31.62 v36.83,29.99 36.83,24.98 40.01,24.98 | 40.01,24.98 42.01,24.98 | 40.01,24.98 40.01,19.8 40.01,19.5 40.01,18.5
  Bottom 0.25: 73.51,21 IC4.3 71.01,21 | 63.02,34.01 63.01,34 | C28.1 77.95,127.63 CONN15.GND1
  Bottom 0.3: IC5.10 63.02,33.99 | IC5.11 63.02,34.01 | IC4.9 74.01,20.5
  Bottom 0.4: 74.01,20.5 73.51,21
  Bottom 0.406: IC21.GND6 IC21.GND7 | IC21.GND9 IC21.GND10 | IC7.5 69.19,75.82 v69.02,75.84
  other vias: 66,115.04 69.01,9 64.01,24.75 48.51,12 19.51,29.25 10.01,10 11.51,18.5 35.51,38 17.5,104.54 75.5,131.84 53.5,126.29 42.5,119.54 74.51,51.5 15.01,53.5 39.51,66.5 31.26,67 49.01,83 72.01,63 69,95.54 63,108.54 70.5,122.04 65,128.04 14,121.04 67.01,39 74.01,28.5 19.51,20.5 52.01,67 56.26,77 42.5,114.04 50.5,107.04 61.51,36.5 54.76,62.85 23.01,78 12.01,78 54.26,57.1 63.01,57.5 30.01,23 23.51,20 63.26,33.75 64.76,32.25 66.51,118.75 74,103.29 69.5,103.29 16.75,114.79 66.51,61.75 76.01,40 76.01,10 14.01,10 14.01,40
  pour Bottom: 0.01,162 84.01,162 84.01,0 0.01,0
  pour Top: 0.01,162 84.01,162 84.01,0 0.01,0
GPIO4
  Top 0.25: R14.1 67.97,108.79 66.89,109.87 IC13.GPIO4
GPIO7
  Top 0.25: R42.2 74.95,109.18 72,112.13 72,112.75 | IC13.GPIO7 65.69,123.35 67.15,121.89
  Top 0.254: 72,112.75 72,117.04 67.15,121.89
GPRS_BUTTON  (via drill 0.25)  (2 unrouted)
  Top 0.25: S4.2 S4.1 23.25,147.76 22.28,148.73 CONN13.7 | R54.1 60.76,67.05 | R22.1 | R22.1 v62.51,64.5 | R22.1 R54.1
  Bottom 0.25: CONN12.7 73.27,64.73 70.8,67.2 65.92,67.2 63.22,64.5 v62.51,64.5
GPRS_LED
  Bottom 0.25: LED6.A R50.2
GPRS_NETLIGHT  (3 unrouted)
  Top 0.25: CONN9.18 61.06,52.05 62.51,53.5 65.33,53.5 73.67,61.84 76.1,61.84 76.64,62.38 CONN12.10
  Bottom 0.25: CONN6.18 61.05,95.44 67.61,102 67.61,109.3 67.96,109.65 IC21.NETLIGHT
  Bottom 0.3: R50.1 24.31,147.8 22.51,146 21.01,146 20.51,146.5 20.51,147.33 CONN13.10
GPS_GREEN_LED_PIN  (2 unrouted)
  Top 0.25: 49.68,26.25 55.69,26.25
  Top 0.254: IC1.42 49.68,26.25 | 55.69,26.25 59.42,29.97 59.42,37.07 58.5,37.99 58.52,38.01 CONN2.17
  Bottom 0.25: CONN8.17 R46.1
GPS_ON_OFF  (via drill 0.25)
  Top 0.25: IC10.ON_OFF 25.01,69.96 v25.01,70 25.01,66.5 26.01,65.5 R56.1 26.01,64.3 IC11.1
  Bottom 0.25: v25.01,70 R36.1
GPS_POWER_CTL_PIN  (via drill 0.25)  (2 unrouted)
  Top 0.25: IC1.49 48,34.79 49.01,35.79 49.01,38 | 49.01,38 49.01,38.13 46.93,40.21 46.55,40.21 45.76,41 45.76,42.59 CONN2.12 | TP5.TP 49.26,38.25 49.01,38 | TP6.TP v21.51,65.5 22.01,65 22.01,64.36 IC11.3
  Top 0.254: 48,34.06 IC1.49
  Bottom 0.25: v21.51,65.5 26.51,65.5 30.01,69 30.01,74 35.01,79 39.51,79 45.82,85.31 CONN8.12
GPS_RED_LED_PIN  (2 unrouted)
  Top 0.25: 55.75,25.41 60.05,29.71
  Top 0.254: 60.05,33.31 60.05,29.71 | IC1.41 55.75,25.41 | CONN2.18 61.06,38.05 60.05,37.04 60.05,35.54 | 60.05,35.54 | 60.05,35.54 60.05,33.31 | 60.05,33.31
  Bottom 0.25: CONN8.18 61.06,83.5 R45.1
GPS_SW_SERIAL_RX  (via drill 0.25)  (2 unrouted)
  Top 0.25: IC8.1 38.94,119.13 v39.01,119.2 | v39.01,119.2 40.94,117.27 IC9.4 | v39.01,119.2 26.1,119.2 13.8,106.9 12.81,106.9 10.01,104.1 7.4,104.1 CONN4.2
  Top 0.3: IC1.14 31.41,20.61 v31.41,20.5 | v12.91,14.1 11.51,14.1 9.61,16 7.47,16 CONN1.2
  Bottom 0.3: v31.41,20.5 31.41,17.31 26.31,12.2 14.81,12.2 v12.91,14.1
GPS_SW_SERIAL_TX  (via drill 0.25)  (2 unrouted)
  Top 0.25: IC10.RX 10.51,69.96 10.51,59 9.08,57.57 CONN7.1 | IC1.15 33.46,19.79 33.44,19.81 31.96,19.81 31.93,19.78 31.79,19.78 v27.26,15 | IC8.3 25.8,117.33 10,101.54 7.42,101.54 CONN4.1
  Bottom 0.25: v27.26,15 11.26,15 9.51,13.5 7.43,13.5 CONN1.1 | C15.2 7.43,57.5 CONN7.1
GPS_TX  (via drill 0.25)  (2 unrouted)
  Top 0.25: IC10.TX v24.76,72.5
  Top 0.254: IC9.1 39,109.68 v38,109.69
  Bottom 0.25: 38,119.54 39.75,121.29 39.75,123.29 43.27,126.81 CONN5.11 | CONN8.11 43.28,85.18 37.73,79.63 34.38,79.63 34.36,79.61 30.62,79.61 26.56,75.55 C16.1 v24.76,72.5
  Bottom 0.3: v38,109.69 38,119.54
GPS_WAKEUP_PIN  (via drill 0.25)  (2 unrouted)
  Top 0.25: CONN2.10 40.74,41.27 42.35,39.66 43.75,39.66 43.8,39.71 46.72,39.71 48.51,37.92 48.51,36 47.22,34.71 IC1.50 | IC10.WAKEUP 10.47,75.04 v10.08,75.43
  Bottom 0.25: v10.08,75.43 10.08,78.57 11.01,79.5 | CONN8.10 40.51,86.65 34.1,80.24 29.51,80.24 28.77,79.5
  Bottom 0.3: 11.01,79.5 28.77,79.5
GREEN_LED  (1 unrouted)
  Top 0.25: CONN13.1 21.34,152.85 21.34,152.94 20.28,154 LED1.K
  Bottom 0.25: R46.2 58.7,81.55 68.41,71.84 72.67,71.84 75.37,69.14 CONN12.1
GSM_ANT
  Bottom 0.25: R52.1 71,124.56 C27.2 70.46,125 66.51,125 65.35,123.84 IC21.GSM_ANT
I2C_SCL_PIN
  Top 0.25: IC1.25 42.47,17.33 42.47,15.42 43.78,14.11 49.4,14.11 50.38,13.13 CONN11.1
I2C_SDA_PIN
  Top 0.25: IC1.26 43.2,15.51 44.02,14.69 49.43,14.69 50.41,15.67 CONN11.2
IREF  (via drill 0.25)
  Top 0.25: IC18.26 37.26,66.5 v39.78,69.02
  Bottom 0.25: v39.78,69.02 R57.2
JTAG_TCL_PIN  (via drill 0.25)  (2 unrouted)
  Top 0.25: v15.01,84 9.01,84 8.01,85 8.01,85.82 | 8.01,85.82 CONN10.1 8.01,85.82 | IC1.57 41.6,33.85 v41.07,34.39
  Bottom 0.25: CONN2.6 30.58,41.43 33.17,38.84 40.17,38.84 41.01,38 41.01,34.5 41.07,34.44 v41.07,34.39 | CONN8.6 30.35,86.65 26.46,82.76 17.02,82.76 | 17.02,82.76 17.01,82.75 | 8.01,85.82 CONN10.1 | 17.02,82.76 16.25,82.76 v15.01,84
JTAG_TDI_PIN  (via drill 0.25)  (2 unrouted)
  Top 0.25: IC1.54 44.02,33.73 v44.33,34.04 | v17.01,80.5 17.01,83.5 14.65,85.86 CONN10.9
  Bottom 0.25: CONN2.9 38.2,40.81 38.43,40.58 41.25,40.58 44.33,37.5 v44.33,34.04 | CONN8.9 37.97,86.65 32.19,80.87 17.81,80.87 17.79,80.86 17.37,80.86 v17.01,80.5
JTAG_TDO_PIN  (via drill 0.25)  (2 unrouted)
  Top 0.25: IC1.55 43.2,34.03 v43.34,34.16
  Bottom 0.25: CONN2.8 35.66,41.35 37.01,40 41.01,40 43.34,37.67 v43.34,34.16 | 25.01,81.5 | 25.01,81.5 30.28,81.5 35.43,86.65 CONN8.8 | 25.01,81.5 17.55,81.5 17.53,81.49 12.52,81.49 9.24,84.77 CONN10.3
JTAG_TMS_PIN  (via drill 0.25)  (2 unrouted)
  Top 0.25: IC1.56 42.42,34.43 v42.35,34.49
  Bottom 0.25: v42.35,34.49 42.35,37.66 40.59,39.42 35.7,39.42 33.12,42 CONN2.7 | CONN8.7 32.89,86.65 28.37,82.13 17.28,82.13 17.27,82.12 13.39,82.12 10.51,85 CONN10.5
L1
  Bottom 0.25: L2.P$1 70.35,22 71.01,22 71.51,21.5 IC4.4
L2
  Bottom 0.25: L2.P$2 70.37,20 71.01,20 71.51,20.5 IC4.2
LEFT  (2 unrouted)
  Top 0.25: IC6.1 54.89,11.38 54.27,10.76 45.27,10.76 43.51,9 43.51,7.58 CONN3.11
  Bottom 0.25: R8.2 C2.2 56.46,68.56 53.4,65.5 53.4,61.31 52.59,60.5 52.59,56.05 50.99,54.44 48.16,54.44 47.86,54.13 45.75,54.13 45.62,54 44.01,54 43.28,53.27 CONN9.11
LTC4425_EN
  Bottom 0.25: IC12.EN 17.4,122.39 17.8,122.79
  Bottom 0.254: 17.8,122.79 R39.2
LTC4425_PROG
  Bottom 0.25: IC12.PROG 16.42,124.34 17.35,124.34 R40.2
MCP73871_CHARGE_STATUS_1_PIN  (via drill 0.25 pad 0.41)
  Top 0.254: IC1.47 51.01,30.21 v51.01,31.7 R30.2
  Bottom 0.25: IC5.8 52.31,33 v51.01,31.7
MCP73871_CHARGE_STATUS_2_PIN  (via drill 0.25 pad 0.41)
  Top 0.25: 53.01,31 v53.01,31.7
  Top 0.254: v53.01,31.7 R29.2 | 53.01,31 51.4,29.39 IC1.46
  Bottom 0.25: IC5.7 54.01,32.5 53.21,31.7 v53.01,31.7
MCP73871_POWER_GOOD_PIN  (via drill 0.25 pad 0.41)
  Top 0.254: R26.2 v55.01,31.7 55.01,31 52.62,28.61 IC1.45
  Bottom 0.25: 55.21,31.7 v55.01,31.7 55.32,32.01 IC5.6
  Bottom 0.254: IC5.6
MENU_BLUETOOTH_POWER_TOGGLE_PIN
  Top 0.25: IC1.39 58.51,23.81 59.97,22.35 IC6.10
MENU_CENTER_BUTTON_PIN
  Top 0.25: IC6.8 62.51,23.25 61.17,24.59 IC1.40
MENU_DOWN_BUTTON_PIN
  Top 0.25: IC6.12 57.43,22.08 56.52,22.99 IC1.38
MENU_GPRS_PUSH_BUTTON_PIN  (via drill 0.7)  (3 unrouted)
  Top 0.25: CONN8.16 55.98,83.97 v55.51,83.5 | IC1.43 49.66,27.03 54.68,27.03 58.15,30.5 58.15,36.54 57.51,37.18 57.51,40 55.98,41.53 CONN2.16 | v55.51,66 56.71,64.8 C30.2 R22.2
MENU_LEFT_BUTTON_PIN
  Top 0.25: IC1.35 49.68,20.55 50.58,20.55 50.87,20.26 50.87,19.14 53.03,16.98 55.53,16.98 56.16,16.35 IC6.2
MENU_RIGHT_BUTTON_PIN
  Top 0.25: IC1.37 49.68,22.15 50.76,22.15 52.13,20.78 52.13,19.66 53.82,17.98 59.53,17.98 61.24,16.27 IC6.6
MENU_UP_BUTTON_PIN
  Top 0.25: IC1.36 49.66,21.37 50.66,21.37 51.5,20.52 51.5,19.4 53.43,17.48 58.03,17.48 58.7,16.81 IC6.4
N$6  (5 unrouted)
N$10  (via drill 0.25)
  Top 0.25: v77.51,77 76.51,78 C3.1
  Bottom 0.25: IC7.3 72.56,74.55 74.46,76.45 IC7.11 IC7.10 77.42,77.09 v77.51,77
N$19
  Bottom 0.25: R1.1 58.93,30.88 R28.2 59.06,28.61 R27.1
N$31
  Top 0.254: R47.1 34.01,11.05 D1.A 34.06,10.95 35.01,10 C22.2
OLED_VCC  (via drill 0.25)
  Top 0.25: IC18.28 36.26,66.48 v33.76,68.98
  Bottom 0.25: v33.76,68.98 C39.2
PDI_UART0_CTS_PIN  (via drill 0.25)  (2 unrouted)
  Top 0.25: IC1.1 33.39,30.99 30.9,33.49 24.01,33.49 | v67.51,80.5 29.01,80.5 24.69,84.82 23.69,84.82 22.96,85.55 CONN8.3
  Top 0.254: CONN2.3 22.96,34.54 24.01,33.49
  Bottom 0.25: v67.51,80.5 67.51,77.5 68.47,76.54 69.31,76.54 69.4,76.45 IC7.6
PDI_UART0_RX_PIN
  Top 0.25: IC1.2 33.28,30.21 30.63,32.86 23.15,32.86
  Top 0.254: R2.1 20.42,35.59 23.15,32.86
PDI_UART0_TX_PIN
  Top 0.25: IC1.3 33.37,29.39 30.42,32.35 23.37,32.35 23.37,32.34 21.41,32.34 17.88,35.88 R3.1
PROG1
  Bottom 0.25: IC5.13 64.01,35.56 64.45,36 65.01,36 R31.1
PROG3
  Bottom 0.25: R32.1 63.01,36.06 63.5,35.57 IC5.12
RED_LED  (1 unrouted)
  Top 0.25: LED2.K 17.51,150.5 19.51,152.5 20.34,152.5 CONN13.2
  Bottom 0.25: R45.2 66.7,75.86 66.7,74.44 68.67,72.47 73.54,72.47 76.64,69.37 CONN12.2
RESET  (via drill 0.25, 0.7)  (5 unrouted)
  Top 0.25: 37.31,14.95 37.69,14.95 37.79,15.05 37.8,15.05 38.26,15.5 | 38.26,15.5 | IC1.20 38.26,17.23 38.26,15.5 | CONN9.17 58.17,51.35 56.43,49.6 7.41,49.6 5.41,51.6 5.41,85.9 7.52,88.01 7.54,88.01 7.58,88.06 10.2,88.06 10.51,87.75 CONN10.6 | R49.2 R47.2 | 33.01,14.95 v33.01,17 | S1.2 16.01,97.4 v16.01,93.63
  Top 0.254: R47.2 37.31,14.95
  Top 0.3: CONN3.17 58.52,8.76 v59.51,9.75
  Bottom 0.25: CONN6.17 58.51,95.5 56.64,93.63 v16.01,93.63
  other vias: 3.01,93
RIGHT  (2 unrouted)
  Top 0.25: IC6.5 59.97,13.96 55.51,9.5 49.01,9.5 48.51,9 48.51,7.5 CONN3.13
  Bottom 0.25: R18.2 C7.2 56.46,58.13 51.51,53.18 48.69,53.18 48.36,52.85 CONN9.13
RTC_INT_INTERRUPT_PIN  (via drill 0.25)  (2 unrouted)
  Top 0.25: IC1.8 32.17,25.41 v32.01,25.25
  Bottom 0.2: 11.26,103.25 11.76,102.75 IC19.!INT!
  Bottom 0.25: v32.01,25.25 32.01,27 29.51,29.5 20.5,29.5 19.8,30.2 11.29,30.2 CONN1.6 | CONN4.6 9.95,114.31 11.26,113 11.26,103.25
RTC_XTAL1
  Bottom 0.2: IC19.X1 19.01,103.25 19.76,104 20.36,104 Q2.XTAL1
RTC_XTAL2
  Bottom 0.2: IC19.X2 19.01,102.75 19.76,102 20.36,102 Q2.XTAL2
RXD  (via drill 0.25)  (2 unrouted)
  Top 0.25: CONN2.1 R3.2 | v67.51,76 67.51,77.5 65.51,79.5 28.15,79.5 v24.08,83.57
  Bottom 0.25: CONN8.1 17.88,85.13 19.44,83.57 v24.08,83.57 | IC7.4 69.36,75.18 69.31,75.14 68.37,75.14 v67.51,76
SD_CARD_DETECT_PIN
  Top 0.25: IC1.5 32.72,27.79 31.26,29.25 30.28,29.25 IC17.DET
SIM800C_CTS_PIN  (via drill 0.25)  (2 unrouted)
  Top 0.25: 45.62,16.04 IC1.29 | CONN6.8 35.88,95.38 38.97,98.47 62.43,98.47 v63,99.04
  Top 0.254: 45.62,16.04 v45.64,16.02
  Bottom 0.25: v45.64,16.02 45.64,12.34 43.78,10.48 38.79,10.48 CONN3.8 | IC21.UART1_CTS 63.15,99.19 v63,99.04
SIM800C_POWER_PIN  (via drill 0.25)  (2 unrouted)
  Top 0.25: IC1.31 47.22,16.05 | TP7.TP v77,108.29 77,102.54 71.67,97.21 42.79,97.21 40.96,95.38 CONN6.10 40.73,95.77
  Top 0.254: 47.22,16.05 v47.26,16.01
  Bottom 0.25: v47.26,16.01 47.26,12.25 44.26,9.25 42.26,9.25 40.74,7.73 CONN3.10 | 74.05,114.04 R51.1 | IC21.PWRKEY 71.76,111.85 R51.1 | R51.1 74,110.26 76.01,108.25 76.96,108.25 v77,108.29
SIM800C_RX_PIN  (via drill 0.25)  (2 unrouted)
  Top 0.25: v66.18,102.04 66.03,101.97 65.4,101.35 63.24,101.35 61.62,99.73 35.15,99.73 30.8,95.38 CONN6.6
  Top 0.254: IC1.27 44.02,16.01 v44.01,15.99
  Bottom 0.25: IC21.UART1_TXD 66.45,102.31 v66.18,102.04 | 43.91,15.9 v44.01,15.99 42.51,14.6 37.41,14.6 30.48,7.67 CONN3.6
SIM800C_STATUS_PIN  (via drill 0.25)  (2 unrouted)
  Top 0.25: v71.5,105.54 71.55,105.49 71.55,101.99 67.41,97.84 40.88,97.84 38.42,95.38 CONN6.9 | IC1.30 46.4,15.71 v46.41,15.5
  Bottom 0.25: v71.5,105.54 71.5,107.54 70.5,108.54 IC21.STATUS | CONN3.9 40.67,9.82 43.83,9.82 46.41,12.4 v46.41,15.5
SIM800C_TX_PIN  (via drill 0.25)  (2 unrouted)
  Top 0.25: CONN6.7 33.34,95.38 37.06,99.1 61.88,99.1 62.65,99.87 64.33,99.87 v65,100.54 | IC1.28 44.8,15.71 v44.81,15.5
  Bottom 0.25: IC21.UART1_RXD 65.35,100.89 v65,100.54 | CONN3.7 33.12,9.26 37.91,14.05 42.7,14.05 43.36,14.05 v44.81,15.5
SIM_CLOCK
  Bottom 0.25: IC21.SIM_CLK 44.5,111.85 IC20.CLK
SIM_DATA  (via drill 0.25)
  Top 0.25: v45.84,108.25 45.84,105.7 46,105.54 C25.1
  Bottom 0.25: IC21.SIM_DATA 46,110.75 44.33,110.75 | v45.84,108.25 45.84,110.59
  Bottom 0.254: 45.84,110.59 46,110.75
  Bottom 0.305: 44.33,110.75 IC20.I/O
SIM_DETECT
  Bottom 0.25: IC21.SIM_DET 48.61,109.65 46,107.04 44.35,107.04
  Bottom 0.305: 44.35,107.04 IC20.CD
SIM_RESET
  Bottom 0.25: IC20.RST 46.44,114.6 48,113.04 50.96,113.04 IC21.SIM_RST
SIM_VDD  (via drill 0.25)
  Top 0.3: v48.07,114.11 47.21,114.11 v46.42,113.32
  Bottom 0.254: IC20.VPP
  Bottom 0.3: IC21.SIM_VDD 48.14,114.05 v48.07,114.11 | v46.42,113.32 IC20.VPP
SPI_FRAM_SS_PIN  (via drill 0.25)
  Top 0.25: R44.1 v13.06,27.91 13.01,28.41 13.01,27 10.94,27 | 32.4,27.01 30.65,27.01 v29.66,28
  Top 0.254: IC16.!CS! 10.94,27 | IC1.6 32.4,27.01
  Bottom 0.25: v29.66,28 13.14,28 v13.06,27.91
SPI_MISO_PIN  (via drill 0.25)  (2 unrouted)
  Top 0.25: 10.97,25.6 12.51,25.6 13.21,24.9 v13.21,21.8 12.51,21.8 9.31,18.6 7.41,18.6 | IC14.SDO v17.81,18.6 19.34,18.6 20.51,19.77 22.03,19.77 24.61,22.35 IC17.DAT0
  Top 0.254: IC17.DAT0
  Top 0.3: IC1.13 27.52,21.39 26.61,22.3 25.69,22.3 IC17.DAT0 | 10.97,25.6 IC16.SO | 7.41,18.6 CONN1.3
  Bottom 0.2: IC19.DOUT 11.01,101.75 10.26,102.5
  Bottom 0.25: 10.26,102.5 10.26,105.75 9.51,106.5 7.54,106.5 CONN4.3 | v17.81,18.6 16.41,18.6 v13.21,21.8
SPI_MOSI_PIN  (via drill 0.25, 0.25 pad 0.25)  (3 unrouted)
  Top 0.25: 34.38,22.22 29.04,22.22 28.34,22.92 v28.34,23.09 | 25.99,19 24.71,17.72 | 24.72,17.71 24.72,16.9 | IC18.19 40.76,58.25 v40.01,59 | IC17.CMD 26.57,26.75 v28,25.32 | CONN4.4 7.37,109.25 9.01,109.25 9.51,108.75 v9.51,105.25
  Top 0.254: 34.38,22.22 IC1.12 | IC16.SI 18.55,23.09 v19.02,23.1 | 25.67,26.78 IC17.CMD | v26.01,19 25.99,19 | 24.71,17.72 24.72,17.71
  Bottom 0.2: IC19.DIN 10.84,101.25 9.68,102.4
  Bottom 0.25: 14.42,23.1 v19.02,23.1 v28.33,23.1 v28.34,23.09 28.33,23 | 14.35,23.17 12.01,23.17 | v40.01,59 16.01,59 9.82,65.19 CONN7.4 | 28.33,23 28.33,25.07 28.09,25.32 v28,25.32 | 28.33,23 28.33,21 26.33,19 v26.01,19 | 9.68,102.4 9.68,105.08 v9.51,105.25
  Bottom 0.254: v28.01,25.31 v28,25.32 | 18.99,23.07 v19.02,23.1 | 14.42,23.1 14.35,23.17 | 12.01,23.17 10.01,21.17 7.38,21.17 CONN1.4
SPI_OLED_D/C_PIN  (via drill 0.25)  (2 unrouted)
  Top 0.25: IC1.17 35.01,17.38 v35.01,17 | IC18.15 42.76,55.75 42.51,55.5 22.51,55.5 20.42,53.41 CONN9.2
  Bottom 0.25: v35.01,17 35.01,16.5 29.14,10.63 22.14,10.63 20.42,8.91 CONN3.2
SPI_OLED_RESET_PIN  (via drill 0.25)  (2 unrouted)
  Top 0.25: IC1.18 36.8,16.25 v36.51,15.96 | IC18.14 43.26,55.25 42.88,54.87 24.38,54.87 23.01,53.5 23.01,51.4 CONN9.3
  Bottom 0.25: 36.47,15.96 v36.51,15.96 30.55,10 23.51,10 22.96,9.45 CONN3.3
SPI_SCK_PIN  (via drill 0.25)  (2 unrouted)
  Top 0.25: IC18.18 41.26,59.75 v41.01,60 | 20.01,22.49 20.01,22.5 15.3,17.79 15.3,15.96 16.26,15 IC14.SCL | IC1.11 31.24,22.99 29.69,24.55 IC17.CLK
  Top 0.254: IC1.11 | IC16.SCK v20,24.36 v20.01,24.36 20.01,22.5 | v24.01,24.52 25.61,24.52 IC17.CLK
  Bottom 0.2: IC19.SCLK 11.51,102.25 10.76,103
  Bottom 0.25: v20.01,24.36 10.68,24.36 | v41.01,60 17.01,60 9.28,67.73 CONN7.5 | CONN4.5 7.37,111.75 9.26,111.75 10.76,110.25 10.76,103
  Bottom 0.254: v24.01,24.52 23.85,24.36 v20.01,24.36 v20,24.35 | 10.68,24.36 10.05,23.73 CONN1.5
SPI_SS_ADXL345_PIN  (via drill 0.25)
  Top 0.25: R43.2 IC15.A 24.01,18.52 v24.48,18.99 | v29.12,26.96 29.88,26.19 IC1.7
  Top 0.254: IC14.!CS! 21.96,15 R43.2
  Bottom 0.25: v24.48,18.99 25.01,18.99 25.71,18.29 26.34,18.29 29.12,21.06 v29.12,26.96
SPI_SS_OLED_PIN  (via drill 0.25)  (2 unrouted)
  Top 0.25: v37.51,15.76 37.51,16.38 37.56,16.43 37.56,17.33 IC1.19 | 25.5,52.49 CONN9.4 25.5,53.49 26.25,54.24 43.25,54.24 43.76,54.75 IC18.13
  Bottom 0.25: CONN3.4 27.36,9.21 30.96,9.21 v37.51,15.76
SPI_SS_RTC_PIN  (2 unrouted)
  Top 0.25: IC1.4 33.45,28.61 30.66,31.4 11.66,31.4 9.07,28.81 CONN1.7
  Bottom 0.2: R55.2 15.46,101.8 15.51,101.75 IC19.!CS!
  Bottom 0.25: 7.45,116.75 CONN4.7 10.16,116.85 11.76,115.25 11.76,110.75 15.46,107.05 R55.2
SPI_SS_SD_CARD_PIN
  Top 0.25: IC1.10 31.16,23.8 27.11,27.85 IC17.CD/DAT3 22.01,27.85
  Top 0.254: 22.06,28 R53.1 22.01,27.85 | IC1.10
THERM
  Bottom 0.25: R28.1 62.65,30.75 IC5.5
TMP36_SHUTDOWN_PIN
  Top 0.25: IC3.4 43.27,38.3 44.06,39.08 46.46,39.08 47.88,37.66 47.88,36.26 46.4,34.79 IC1.51
TMP36_VSENSE_PIN
  Top 0.25: IC3.1 39.46,35.7 38.76,35 38.76,34.75 38.4,34.39 IC1.61
TXD  (via drill 0.25)  (2 unrouted)
  Top 0.25: CONN2.2 R2.2 | CONN8.2 20.42,85.59 27.51,78.5 65.51,78.5 66.51,77.5 66.51,75.5 68.73,73.28 v69.01,73.28
  Bottom 0.25: IC7.1 v69.01,73.28
UP  (2 unrouted)
  Top 0.25: IC6.3 57.43,12.31 55.25,10.13 47.14,10.13 46.01,9 46.01,7.54 CONN3.12
  Bottom 0.25: R12.2 C5.2 56.44,64.5 56.44,63 53.23,59.78 53.23,55.78 51.25,53.81 48.42,53.81 48.12,53.5 46.01,53.5 45.82,53.31 CONN9.12
USB_D+
  Bottom 0.25: R7.1 72.01,82.83 71.1,83.74 71.1,84.89 CONN14.DP
USB_D-
  Bottom 0.25: R6.2 75.01,83 CONN14.DN
USB_RX_LED
  Top 0.25: LED3.A 72.01,79.05 R4.2
USB_TX_LED
  Top 0.25: LED4.A 75.01,79.05 R5.2
USBDM
  Bottom 0.25: IC7.9 76.23,78.33 R6.1
USBDP
  Bottom 0.25: IC7.8 70.79,78.33 R7.2
V_LIION+
  Top 0.3: CONN16.1 77.01,36.95 C13.1
  Bottom 0.3: IC5.14 IC5.15 65.89,34.88 | 65.89,34.88 IC5.16 | R34.1 71.01,36 | 65.89,34.88 67.01,36 71.01,36 | 71.01,36 75.51,36 CONN16.1
V_LIION_REGULATED  (via drill 0.25)  (2 unrouted)
  Top 0.25: v46.01,66 47.26,64.75 IC18.6
  Top 0.3: 63.51,86.56 CONN8.19 | v44.01,81.5 58.51,81.5 S2.2 | 63.6,39.91 70.51,33 70.51,30.25 v71.01,29.75 77.01,23.75 v77.01,21.5
  Top 0.305: 63.59,42.67 CONN2.19 | S2.2 61.51,82.5 63.51,84.5 63.51,86.56
  Top 0.406: TP8.TP 70.51,29.25 v71.01,29.75 | CONN2.19 63.6,39.91
  Bottom 0.3: 65.89,31.12 IC5.1 | 65.89,31.12 67.01,31.12 C11.1 70.81,29.95 v71.01,29.75 71.01,26.05 | IC5.20 65.89,31.12 | IC4.5 72.51,23.45 71.06,24.9 | IC4.8 IC4.7 v77.01,21.5 | v46.01,66 C38.2 43.46,80.95 v44.01,81.5
  Bottom 0.406: 70,117.35 74,117.35 | 70,117.35 IC21.VBAT1 60.95,117.35 IC21.VRTC 61,121.4 61,123.04 63.59,125.63 CONN5.19 | 74,117.35 C26.2 | 74,117.35 R51.2 74,116.25 IC21.VBAT2 70,116.25 70,117.35 | 71.06,24.9 C42.2 71.01,26.05
VCC  (via drill 0.25, 0.5, 0.7)  (15 unrouted)
  Top 0.3: R30.1 R29.1 | R29.1 R26.1 | 29.49,37.95 L1.1 | 29.49,37.95 R25.1 | C14.1 43.96,36.05 43.01,37 41.01,37 | 40.99,36.45 40.99,35.73 IC3.2 41.01,37 | 41.01,37 39.48,37 v39.31,36.82 | v29.49,36.77 29.49,37.95 | R43.1 25.06,11.05 26.01,12 26.01,14 24.91,15.1 | R43.1 24.06,11 D1.C 31.96,13 R49.1 30.06,13.05 v30.01,13 | 14.96,18.95 14.01,18 14.01,15 v15.46,13.55 16.01,13 16.61,13 IC14.VDD | IC1.21 39.22,16.02 v39.23,15.74 | C14.1 46.02,36.05 v46.47,36.05 | IC1.52 45.62,35.44 C14.1 | 71.6,16 TP2.TP | 71.6,16 63.6,8 CONN3.19 63.6,10.41 v63.51,10.5 | v54.01,21.5 54.89,20.62 IC6.14 54.89,18.62 55.01,18.5 69.1,18.5 71.6,16 | 73.01,16.5 v74.51,18 | 41.5,128.84 45.76,128.84 46.61,127.99 T1.2 | 41.5,128.84 25.5,128.84 | 21.73,125.07 v21.58,125.07 21.58,125.43 19.97,127.04 11.94,127.04 v11.94,126.54 15.5,123.48 | CONN5.4 25.49,129.04 21.58,125.13 | 41.5,128.84 R15.2 40.44,127.48 40,127.04 40,120.04 v43,117.04 | LED1.A LED2.A 14.63,150.5 15.8,149.33 17.24,149.33 17.9,150 CONN13.6 | IC18.9 v45.76,64 44.76,64 43.01,65.75 43.01,71.5 45.51,74 55.51,74 v57.01,72.5 v57.01,67 R54.2 | v57.01,61.5 R20.2 | v57.01,56 R19.2 | 29.51,82.5 v46.01,82.5 | IC8.5 38,111.77 | 38,111.77 38.57,111.19 39.55,111.19 40,111.64 IC9.5 | v15.5,121.04 15.5,123.48 | 15.5,123.48 15.56,123.54 17.47,123.54 v17.51,123.5 | IC16.!WP! 10.12,24.36 v9.21,25.28 | R29.1 v53.01,36.5 | 15.26,20 v15.26,25.25 15.64,25.64 IC16.!HOLD! IC16.VCC 19.66,26.91 v19.76,27 20.71,26.05 R53.2 22.01,25.5 | v21.91,13.4 IC14.VCC 21.01,12.5 21.46,12.05 C17.1 24.01,11 R43.1 | IC15.VCC 25.01,15.1 | v12.21,108.6 12.21,114.9 15.51,118.2 v15.51,118.3 | 22.01,25.5 C31.1 | IC17.VDD 22.16,25.65 22.01,25.5
  Top 0.3: IC11.6 25.66,61.7 R56.2 28.01,62.05 C34.2 28.06,63.55 v28.51,64 | CONN9.19 63.91,51.35 65.68,49.58 70.84,49.58 v72.26,51 72.26,55.25 77.59,60.58 77.59,65.12 77.04,65.68 76.96,65.68 CONN12.6 | CONN2.4 v25.5,40.01 v25.51,40 27.01,40 28.01,39 R25.1 | R25.1 28.01,38.25 | 38,111.77 35.53,111.77 v35.51,111.75 | 19.01,127.04 19.47,127.04
  Top 0.305: IC16.VCC 17.08,28.43 16.01,29.5 R44.2 | 24.91,15.1 IC15.VCC | 25.49,129.04 25.49,128.85 25.5,128.84 | v21.58,125.07 21.58,125.13 | v40,114.04 IC9.5 | 25.5,86.51 29.51,82.5 | 14.96,18.95 C41.1 15.26,20
  Top 0.406: 25.5,41.51 CONN2.4 | TP2.TP 73.01,16.5 | CONN8.4 25.5,86.51
  Bottom 0.3: IC4.1 72.51,19.5 73.01,19 75.01,19 | 75.01,19 75.51,19.5 IC4.10 | v39.31,36.82 29.53,36.82 29.51,36.84 29.51,36.79 v29.49,36.77 | v21.58,125.07 21.55,125.04 | IC12.VIN2 IC12.VIN1 | 75.01,19 76.01,19 76.01,18.05 C18.2 76.46,18 v74.51,18 73.01,16.5 TP2.TP | R13.2 v57.01,67 | R21.2 v57.01,61.5 | R11.2 v57.01,56 | v46.01,82.5 46.01,82 55.51,72.5 v57.01,72.5 | IC20.VCC 43.1,117.14 v43,117.04 v40,114.04 | 15.4,121.14 v15.5,121.04 v15.51,121.03 v15.51,118.3 | 16.5,123.54 16.25,123.29 IC12.FB IC12.SEL 16.34,123.5 v17.51,123.5 | v9.21,25.28 9.29,25.28 10.01,26 14.51,26 v15.26,25.25 | v21.91,13.4 15.61,13.4 v15.46,13.55 | v12.21,108.6 13.56,107.55 R55.1 13.51,105.75 12.51,104.75 IC19.VCC 13.51,103.25 14.26,102.5 14.26,101.55 C32.1 | 21.51,125.14 v21.58,125.07 | 21.51,123.75 21.51,125 v21.58,125.07 | C21.2 21.95,125.44 v21.58,125.07 | C37.2 45.01,63.25 v45.76,64 | CONN6.19 63.59,97.24 64.06,97.7 71.06,97.7 72.26,96.5 v72.26,95.5 | CONN8.4 25.19,86.65 23.42,88.42 9.68,88.42 9.26,88 9.26,87.15 CONN10.4 | IC12.VIN2 11.95,125.94 | v11.94,126.54 IC12.VIN2 | 21.51,124 21.51,123.5 20.01,122
  Bottom 0.406: v57.01,72.5 R9.2
VCC_SENSE_PIN  (via drill 0.25)
  Top 0.25: IC1.60 39.22,33.92 | 27.01,36.05 R35.1 | 27.01,36.05 R25.2 | v27.01,34.5 27.01,36.05
  Top 0.254: 39.22,33.92 v39.21,34.17
  Bottom 0.25: 34.84,34.17 v39.21,34.17 | v27.01,34.5 34.51,34.5
  Bottom 0.254: 34.51,34.5 34.84,34.17
VCOMH  (via drill 0.25)
  Top 0.25: IC18.27 v36.76,69.4
  Bottom 0.25: v36.76,69.4 36.76,71.53 C12.2
VGPS  (via drill 0.25)  (4 unrouted)
  Top 0.3: 10.5,119.39 21.45,119.39 C43.+ | 10.5,119.39 10.01,119.39 | 10.01,119.39 CONN4.8 | TP10.TP 10.5,119.39 | IC10.VCC 25.51,73.77 | v18.01,102 22.01,106 v22.01,111.25 | C35.1 19.51,62.95 v19.51,61.5 TP11.TP 22.51,60 23.01,60.5 IC11.5 | v28.01,65.5 28.01,71.27 25.51,73.77 | 25.51,73.77 25.51,78 24.01,79.5 15.51,79.5 14.34,80.67 C1.1 12.68,80.67 CONN7.8 | v16.94,126.25 18.25,126.25 19.51,125 19.51,119.5 | 10.01,119.39 v10.01,120.5
  Top 0.305: CONN1.8 8.36,31.35 10.01,33 R48.1
  Bottom 0.2: IC19.VBACK 17.76,102.25 v18.01,102
  Bottom 0.3: 22.01,120.03 v22.01,111.25 | v19.51,61.5 24.01,61.5 v28.01,65.5 | IC12.VOUT2 16.2,125.04 16.2,125.59 IC12.VOUT1 16.33,125.64 v16.94,126.25 | v10.01,120.5 R60.2
VGPS_SENSE_PIN  (via drill 0.25)
  Top 0.25: IC1.59 40,31.49 v39.44,30.93
  Top 0.254: 12.96,34 R48.2 | 12.96,34 R58.1 | v39.44,30.93 39.49,30.98 | v15.01,34 12.96,34
  Bottom 0.25: v15.01,34 16.01,33 37.87,33 v39.44,30.93
VMID
  Bottom 0.25: R61.2 R60.1 10.39,124.33 IC12.VMID
  Bottom 0.254: 11.82,124.29 IC12.VMID
VPCC
  Bottom 0.25: R23.2 R24.1 63.06,27.63 64.52,29.09 IC5.2
VUSB  (via drill 0.5)  (1 unrouted)
  Top 0.3: R4.1 R5.1 74.51,83.33 74.92,83.74 74.92,84.66 74.61,84.97 CONN14.VBUS 74.61,88.1 v74.76,88.25
  Bottom 0.406: 78.16,58.85 78.51,58.5 78.51,57.5 L3.P$1
XTAL1
  Top 0.25: IC1.24 41.6,14.75 41.91,14.44 C24.2 43.05,12.95 Q1.1
XTAL2
  Top 0.25: Q1.2 38.97,12.95 C23.2 40.11,14.1 40.82,14.81 IC1.23

## Text on the board
tPlace: 2 | 10 | 1 | 9 | RX | TX | RESET | GND | GPS PWR | VLiIon
tNames: GPS G | BT | GPS R | GPRS | Bluetooth | GPRS | BT RST | BT GPIO6 | BT wakeup | IC13 | BT | VGPS | SIM800 PWR | GPS | Miško v.2 | Hrvoje Ivanić | Stjenka Bojanić | SW CTRL | ON | OFF | IC10 | GPRS | GPS PWR | BT | VGPS | Miško v.2 | C | Hrvoje Ivanić | Stjenka Bojanić | R1 | IC17 | Miško v.2 | Hrvoje Ivanić | Stjenka Bojanić | SDA | VCC | SCL
bNames: IC20 | IC21 | 32k768 | L | U | R | D | VCC